# Altium schematic sheet Buck Converter.SchDoc
size A; SheetNumber: 1; SheetTotal: 1
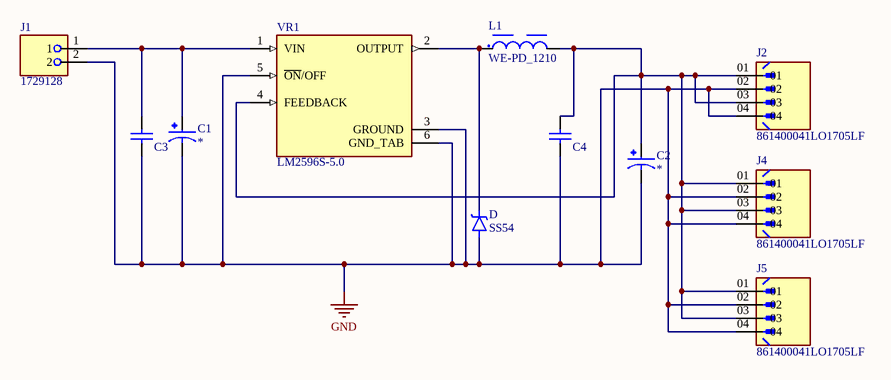
[diagram p0: Buck Converter.SchDoc]

## Parts
C1  EEEFK1V221P  [CAP_EEEFK1V221P]  (value not drawn)
C2  EEEFK1V221P  [CAP_EEEFK1V221P]  (value not drawn)
C3  GRM188R71H104KA93D  [CAPC1608X90X35ML10T15]  (value not drawn)
C4  GRM188R71H104KA93D  [CAPC1608X90X35ML10T15]  (value not drawn)
D  SS54  [DO-214AC]
J1  1729128  [PHOENIX_1729128]
J2  861400041LO1705LF  [AMPHENOL_861400041LO1705LF]
J4  861400041LO1705LF  [AMPHENOL_861400041LO1705LF]
J5  861400041LO1705LF  [AMPHENOL_861400041LO1705LF]
L1  WE-PD_1210  [WE-PD_1210]
VR1  LM2596S-5.0  [TO170P1524X483-6N]

## Nets
GND: C1.2 C2.2 C3.1 C4.1 D.A J1.2 J2.02 J2.04 J4.02 J4.04 J5.02 J5.04 VR1.3(GROUND) VR1.5(~{ON}/OFF) VR1.6(GND_TAB)
NetC1_1: C1.1 C3.2 J1.1 VR1.1(VIN)
NetC2_1: C2.1 C4.2 J2.01 J2.03 J4.01 J4.03 J5.01 J5.03 L1.2 VR1.4(FEEDBACK)
NetD_C: D.C L1.1 VR1.2(OUTPUT)

## Library data of the parts
C1 C2 = CMP-007-000000-1: 220ÂµF 35V Aluminum Electrolytic Capacitors Radial, Can - SMD 2000 Hrs @ 105Â°C; MF: Panasonic; SnapEDA_Link: https://www.snapeda.com/parts/EEEFK1V221P/Panasonic/view-part/?ref=snap; Component Type: Standard; Pin Count: 2; Check_prices: https://www.snapeda.com/parts/EEEFK1V221P/Panasonic/view-part/?ref=eda; Value: *; Design Item ID: EEEFK1V221P; Package: RADIAL-2 Panasonic; MP: EEEFK1V221P; Source: EEEFK1V221P.SchLib
C3 C4 = CMP-001-00084-1: Multilayer Ceramic Capacitors MLCC Surface Mount 0603 0.1uF 50 Volts X7R 10%
D = CMP-003-000000-1: Digital Switch Unipolar Switch Open Collector Hall Effect SOT-89B; MF: Honeywell Sensing; Design Item ID: SS54; Component Type: Standard; Pin Count: 2; SnapEDA_Link: https://www.snapeda.com/parts/SS54/Honeywell%20Sensing%20and%20Productivity%20Solutions/view-part/564047/?ref=snap; Value: *; Availability: Unavailable; Source: SnapEDAsch.SchLib; Package: TO-243AA-243 Honeywell Sensing; MP: SS54; Price: None
J1 = CMP-013-000000-1: PCB Terminal Screw 5.08mm 16AWG 400V 13.5A 2 Position COMBICON MKDSN Series; MF: Phoenix Contact; SnapEDA_Link: https://www.snapeda.com/parts/1729128/Phoenix+Contact/view-part/?ref=snap; Source: 1729128.SchLib; Component Type: Standard; Value: *; MP: 1729128; Check_prices: https://www.snapeda.com/parts/1729128/Phoenix+Contact/view-part/?ref=eda; Pin Count: 2; Package: None; Design Item ID: 1729128
J2 J4 J5 = CMP-027-000000-1: Board to Board connector, Unshrouded Header, Through Hole, Single Row, 4 Position, Right Angle.; MF: Amphenol ICC (FCI); Package: None; Availability: In Stock; Pin Count: 4; Check_prices: https://www.snapeda.com/parts/861400041LO1705LF/Amphenol+FCI/view-part/?ref=eda; Price: None; MP: 861400041LO1705LF; Source: 861400041LO1705LF.SchLib; SnapEDA_Link: https://www.snapeda.com/parts/861400041LO1705LF/Amphenol+FCI/view-part/?ref=snap; Design Item ID: 861400041LO1705LF; Value: *; Component Type: Standard; Purchase-URL: https://pricing.snapeda.com/search/part/861400041LO1705LF/?ref=eda
L1 = WE-PD_1210: MF: {'manufacturer': u'W\xfcrth Elektronik'}; MP: 7447709330; Package: None; Price: None; Value: *; Availability: Unavailable
VR1 = CMP-011-000001-1: SIMPLE SWITCHERÂ® 4.5V to 40V, 3A Low Component Count Step-Down Regulator; MF: Texas Instruments; MP: LM2596S-5.0/NOPB; Package: TO-263-5 Texas Instruments; Source: LM2596S-5.0.SchLib; SnapEDA_Link: https://www.snapeda.com/parts/LM2596S-5.0/NOPB/Texas+Instruments/view-part/?ref=snap; Value: *; Design Item ID: LM2596S-5.0; Component Type: Standard; Check_prices: https://www.snapeda.com/parts/LM2596S-5.0/NOPB/Texas+Instruments/view-part/?ref=eda; Pin Count: 6